# Altium project Comp_Bordo.PrjPcb (part 1 of 2)
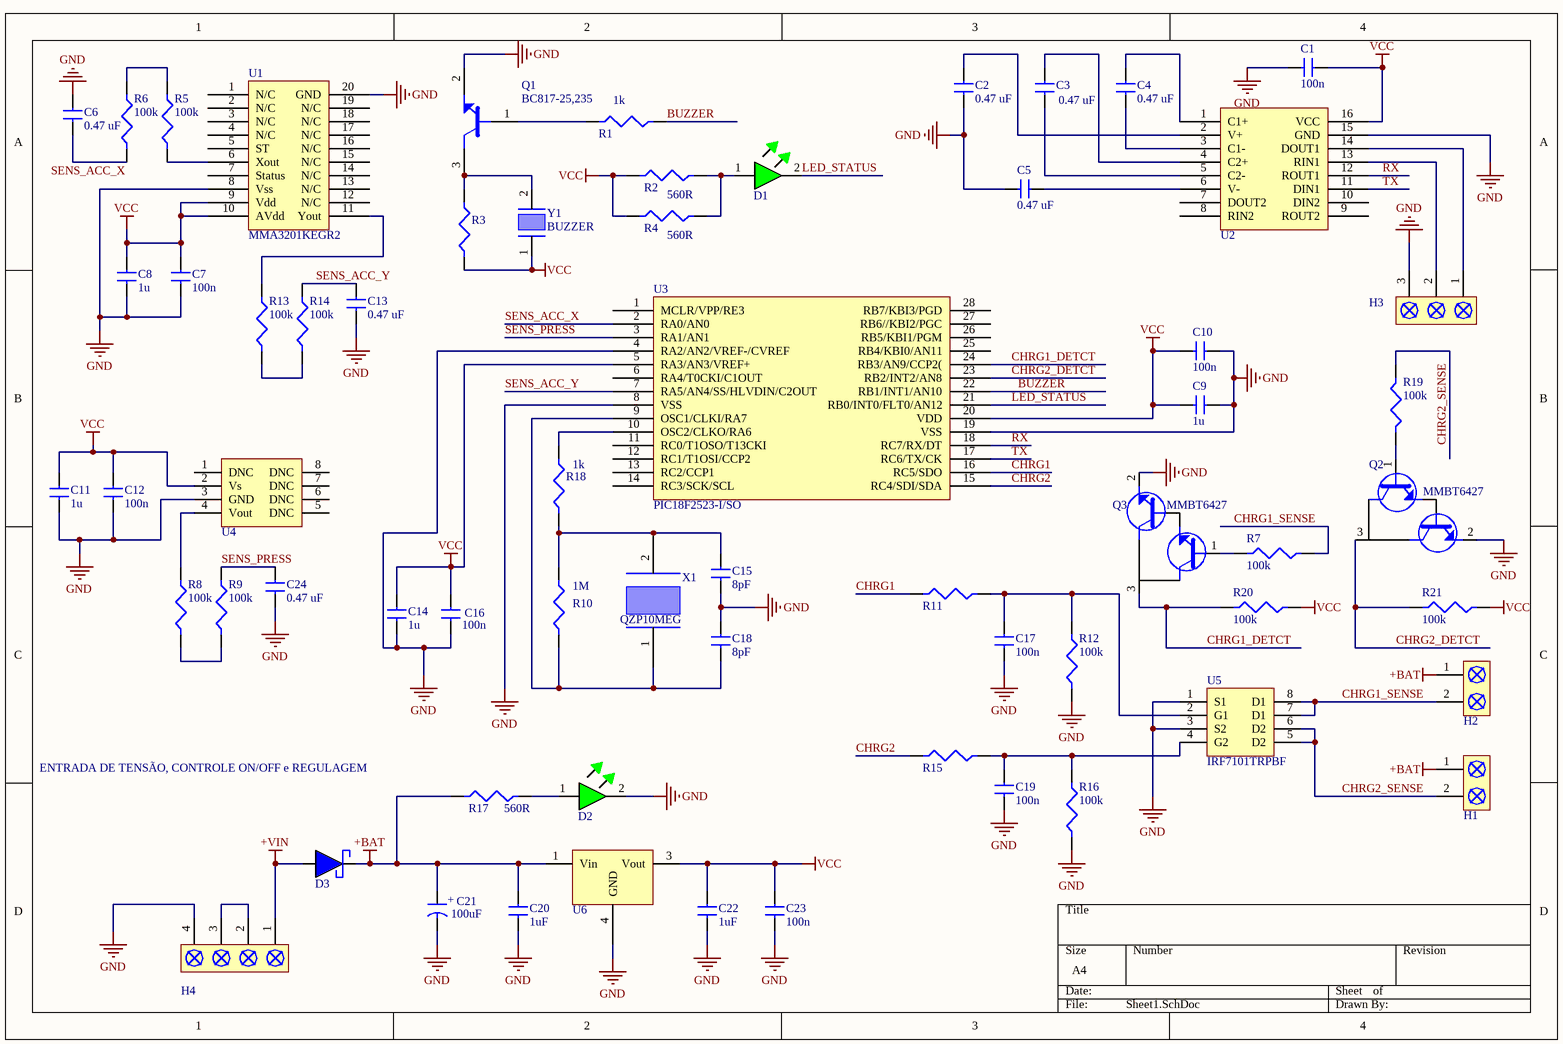
[diagram p0: Sheet1.SchDoc]
1 sheet, 63 parts. Net scope: global (net labels, ports and power ports of the same name join across sheets).
Board file: PCB1.PcbDoc

## Sheet Sheet1.SchDoc
size A4; SheetNumber: 1; SheetTotal: 1

### Parts
C1  100n  [GRM155R71C104KA88D]
C2  0.47 uF  [TMK107F474ZA-T]
C3  0.47 uF  [TMK107F474ZA-T]
C4  0.47 uF  [TMK107F474ZA-T]
C5  0.47 uF  [TMK107F474ZA-T]
C6  0.47 uF  [TMK107F474ZA-T]
C7  100n  [GRM155R71C104KA88D]
C8  1u  [CC1206KKX7R7BB105]
C9  1u  [CC1206KKX7R7BB105]
C10  100n  [GRM155R71C104KA88D]
C11  1u  [CC1206KKX7R7BB105]
C12  100n  [GRM155R71C104KA88D]
C13  0.47 uF  [TMK107F474ZA-T]
C14  1u  [CC1206KKX7R7BB105]
C15  8pF  [GRM1555C1H8R0DZ01D]
C16  100n  [GRM155R71C104KA88D]
C17  100n  [GRM155R71C104KA88D]
C18  8pF  [GRM1555C1H8R0DZ01D]
C19  100n  [GRM155R71C104KA88D]
C20  1uF  [TPSA105K020R3000]
C21  100uF  [B45197A3107K509]
C22  1uF  [TPSA105K020R3000]
C23  100n  [GRM155R71C104KA88D]
C24  0.47 uF  [TMK107F474ZA-T]
D1  LED_ON  [LNJ314G8TRA]  (value not drawn)
D2  LED_ON  [LNJ314G8TRA]  (value not drawn)
D3  SD0805S020S1R0  [SD0805S020S1R0]  (value not drawn)
H1  1725656  [MPT 0,5/ 2-2,54]  (value not drawn)
H2  1725656  [MPT 0,5/ 2-2,54]  (value not drawn)
H3  1725669  [MPT 0,5/ 3-2,54]  (value not drawn)
H4  MPT0,5/4-2,54  [MPT 0,5/ 4-2,54]  (value not drawn)
Q1  BC817-25,235  [BC817-25,235]
Q2  MMBT6427  [MMBT6427-7-F]
Q3  MMBT6427  [MMBT6427-7-F]
R1  1k  [CRCW04021K00JNED]
R2  560R  [CRCW0402560RJNED]
R3  1k  [CRCW04021K00JNED]  (value not drawn)
R4  560R  [CRCW0402560RJNED]
R5  100k  [MCT0603PD1003DP500]
R6  100k  [MCT0603PD1003DP500]
R7  100k  [RCA0402100KFKED]
R8  100k  [MCT0603PD1003DP500]
R9  100k  [MCT0603PD1003DP500]
R10  1M  [CRCW04021M00FKED]
R11  1k  [CRCW04021K00JNED]  (value not drawn)
R12  100k  [MCT0603PD1003DP500]
R13  100k  [MCT0603PD1003DP500]
R14  100k  [MCT0603PD1003DP500]
R15  1k  [CRCW04021K00JNED]  (value not drawn)
R16  100k  [MCT0603PD1003DP500]
R17  560R  [CRCW0402560RJNED]
R18  1k  [CRCW04021K00JNED]
R19  100k  [RCA0402100KFKED]
R20  100k  [MCT0603PD1003DP500]
R21  100k  [MCT0603PD1003DP500]
U1  MMA3201KEGR2  [MMA3201KEG]
U2  MAX3232IPWR  [MAX3232IPWR]  (value not drawn)
U3  PIC18F2523-I/SO  [PIC18F2523-I/SO]
U4  MPXH6115A6U  [MPXH6115A6U]  (value not drawn)
U5  IRF7101TRPBF  [IRF7101TRPBF]
U6  MC78M05BDTG  [MC78M05BDTG]  (value not drawn)
X1  QZP10MEG  [NX5032GA-10.000000MHZ]
Y1  BUZZER  [PKLCS1212E4001-R1]

### Nets
+BAT: C20.2 C21.1 D3.2 H1.1 H2.1 R17.1 U6.1(Vin)
+VIN: D3.1 H4.1
GND: C1.1 C2.1 C5.1 C6.2 C7.1 C8.2 C9.2 C10.2 C11.1 C12.1 C13.1 C14.1 C15.1 C16.1 C17.1 C18.2 C19.1 C20.1 C21.2 C22.1 C23.1 C24.1 D2.2 H3.3 H4.4 Q1.2 Q2.2 Q3.2 R12.2 R16.2 U1.8(Vss) U1.20(GND) U2.15(GND) U3.4(RA2/AN2/VREF-/CVREF) U3.8(VSS) U3.19(VSS) U4.3(GND) U5.1(S1) U5.3(S2) U6.4(GND)
VCC: C1.2 C7.2 C8.1 C9.1 C10.1 C11.2 C12.2 C14.2 C16.2 C22.2 C23.2 R2.1 R3.1 R4.1 R20.2 R21.2 U1.9(Vdd) U1.10(AVdd) U2.16(VCC) U3.5(RA3/AN3/VREF+) U3.20(VDD) U4.2(Vs) U6.3(Vout) Y1.1
BUZZER: R1.1 U3.22(RB1/INT1/AN10)
CHRG1: R11.2 U3.16(RC5/SDO)
CHRG1_DETCT: Q3.3 R20.1 U3.24(RB3/AN9/CCP2()
CHRG1_SENSE: H2.2 R7.2 U5.7(D1) U5.8(D1)
CHRG2: R15.2 U3.15(RC4/SDI/SDA)
CHRG2_DETCT: Q2.3 R21.1 U3.23(RB2/INT2/AN8)
CHRG2_SENSE: H1.2 R19.2 U5.5(D2) U5.6(D2)
LED_STATUS: D1.2 U3.21(RB0/INT0/FLT0/AN12)
RX: U2.12(ROUT1) U3.18(RC7/RX/DT)
SENS_ACC_X: C6.1 R6.2 U3.2(RA0/AN0)
SENS_ACC_Y: C13.2 R14.2 U3.7(RA5/AN4/SS/HLVDIN/C2OUT)
SENS_PRESS: C24.2 R9.2 U3.3(RA1/AN1)
TX: U2.11(DIN1) U3.17(RC6/TX/CK)
NetC2_2: C2.2 U2.2(V+)
NetC3_1: C3.1 U2.5(C2-)
NetC3_2: C3.2 U2.4(C2+)
NetC4_1: C4.1 U2.3(C1-)
NetC4_2: C4.2 U2.1(C1+)
NetC5_2: C5.2 U2.6(V-)
NetC15_2: C15.2 R10.1 R18.2 X1.2
NetC17_2: C17.2 R11.1 R12.1 U5.2(G1)
NetC18_1: C18.1 R10.2 U3.9(OSC1/CLKI/RA7) X1.1
NetC19_2: C19.2 R15.1 R16.1 U5.4(G2)
NetD1_1: D1.1 R2.2 R4.2
NetD2_1: D2.1 R17.2
NetH3_1: H3.1 U2.14(DOUT1)
NetH3_2: H3.2 U2.13(RIN1)
NetH4_2: H4.2 H4.3
NetQ1_1: Q1.1 R1.2
NetQ1_3: Q1.3 R3.2 Y1.2
NetQ2_1: Q2.1 R19.1
NetQ3_1: Q3.1 R7.1
NetR5_1: R5.1 U1.6(Xout)
NetR5_2: R5.2 R6.1
NetR8_1: R8.1 U4.4(Vout)
NetR8_2: R8.2 R9.1
NetR13_1: R13.1 U1.11(Yout)
NetR13_2: R13.2 R14.1
NetR18_1: R18.1 U3.10(OSC2/CLKO/RA6)

Not connected (* = marked no-connect by the designer): U1 1(N/C) 2(N/C) 3(N/C) 4(N/C) 5(ST) 7(Status) 12(N/C) 13(N/C) 14(N/C) 15(N/C) 16(N/C) 17(N/C) 18(N/C) 19(N/C); U2 7(DOUT2) 8(RIN2) 9(ROUT2) 10(DIN2); U3 1(MCLR/VPP/RE3) 6(RA4/T0CKI/C1OUT) 11(RC0/T1OSO/T13CKI) 12(RC1/T1OSI/CCP2) 13(RC2/CCP1) 14(RC3/SCK/SCL) 25(RB4/KBI0/AN11) 26(RB5/KBI1/PGM) 27(RB6//KBI2/PGC) 28(RB7/KBI3/PGD); U4 1(DNC) 5(DNC) 6(DNC) 7(DNC) 8(DNC)

### Notes on the sheet
- ENTRADA DE TENSÃO, CONTROLE ON/OFF e REGULAGEM
- (in symbol B45197A3107K509) +